# EAGLE design sklpf (EAGLE 7.7.0)
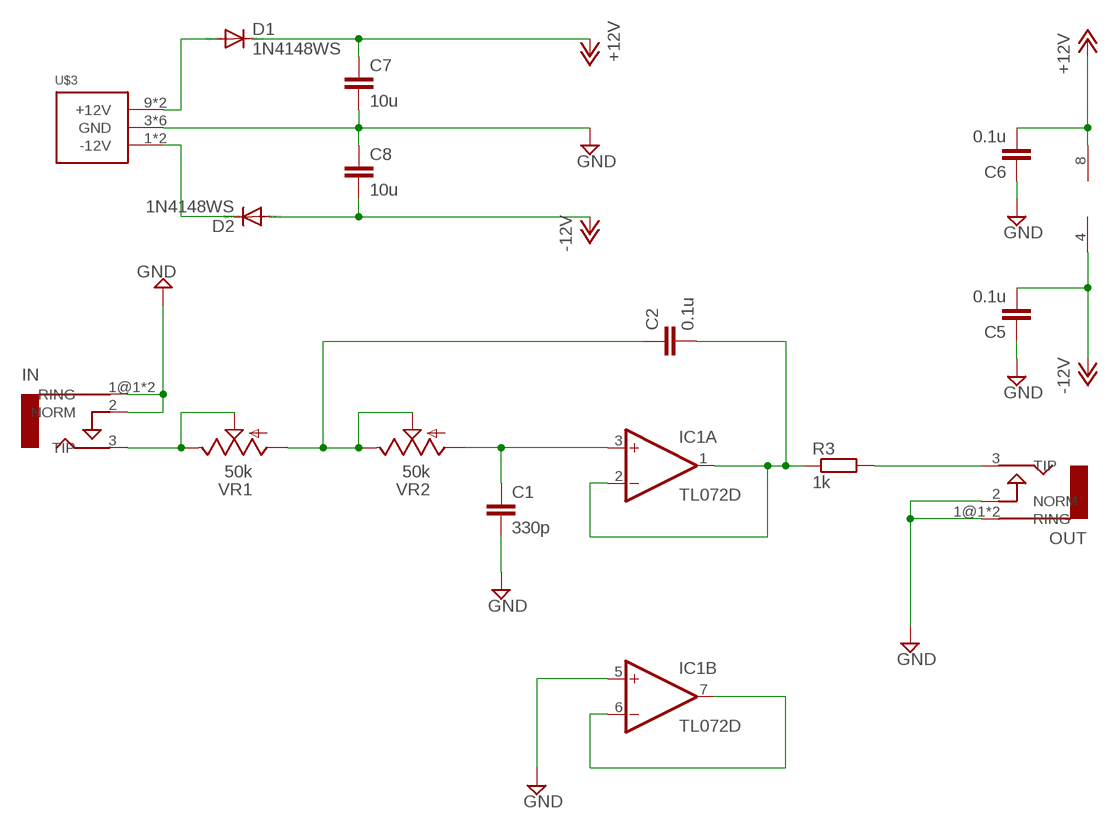
[diagram p0: schematic, sheet 1]

## Parts
C1  330p  C-EUC0805  [C0805]
C2  0.1u  C-EUC0805  [C0805]
C5  0.1u  C-EUC0805  [C0805]
C6  0.1u  C-EUC0805  [C0805]
C7  10u  C-EUC0805  [C0805]
C8  10u  C-EUC0805  [C0805]
D1  1N4148WS  DIODE-SOD323-W  [SOD323-W]
D2  1N4148WS  DIODE-SOD323-W  [SOD323-W]
IC1  TL072D  [SO08]
IN  AUDIO-JACKERTHENVAR  [ERTHENVAR-JACK]
OUT  AUDIO-JACKERTHENVAR  [ERTHENVAR-JACK]
R3  1k  R-EU_R0805  [R0805]
U$3  POWER_SIMPLE10  [POWER_10]
VR1  50k  9MM_SNAP-IN_POT_  [9MM_SNAP-IN_POT]
VR2  50k  9MM_SNAP-IN_POT_  [9MM_SNAP-IN_POT]

## Nets
+12V: C6.2 C7.1 D1.C IC1.8(P:V+)
-12V: C5.2 C8.2 D2.A IC1.4(P:V-)
GND: C1.2 C5.1 C6.1 C7.2 C8.1 IC1.5(B:+IN) IN.1@1(RING) IN.1@2(RING) IN.2(NORM) OUT.1@1(RING) OUT.1@2(RING) OUT.2(NORM) U$3.3(GND) U$3.4(GND) U$3.5(GND) U$3.6(GND) U$3.7(GND) U$3.8(GND)
N$1: C2.2 IC1.1(A:OUT) IC1.2(A:-IN) R3.1
N$2: C1.1 IC1.3(A:+IN) VR2.1(A)
N$3: C2.1 VR1.1(A) VR2.2(S) VR2.3(E)
N$4: IN.3(TIP) VR1.2(S) VR1.3(E)
N$5: IC1.6(B:-IN) IC1.7(B:OUT)
N$6: OUT.3(TIP) R3.2
N$9: D2.C U$3.1(-12V) U$3.2(-12V)
N$10: D1.A U$3.9(+12V) U$3.10(+12V)

## Library data of the parts
C1 C2 C5-C8 = rcl:C-EU: CAPACITOR, European symbol
D1 D2 = diode:DIODE-: DIODE
IC1 = linear:TL072: OP AMP
IN OUT = erthenvar:AUDIO-JACK: Switching Mono 3.5mm Audio Jack from Erthenvar.
R3 = rcl:R-EU_: RESISTOR, European symbol
U$3 = eurorack:POWER_SIMPLE
VR1 VR2 = MusicThingModular:9MM_SNAP-IN_POT: 9mm vertical snap-in pot, Alpha / Panasonic style

## Board
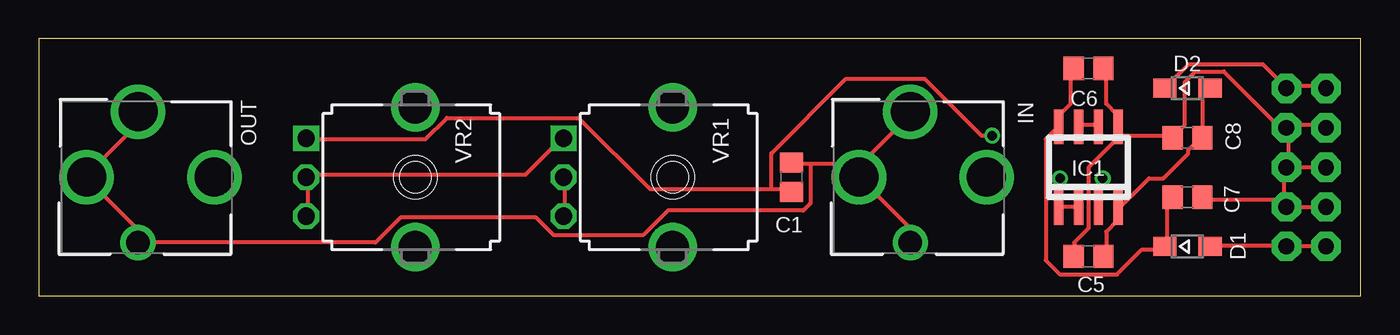
[diagram p1: board, top side]
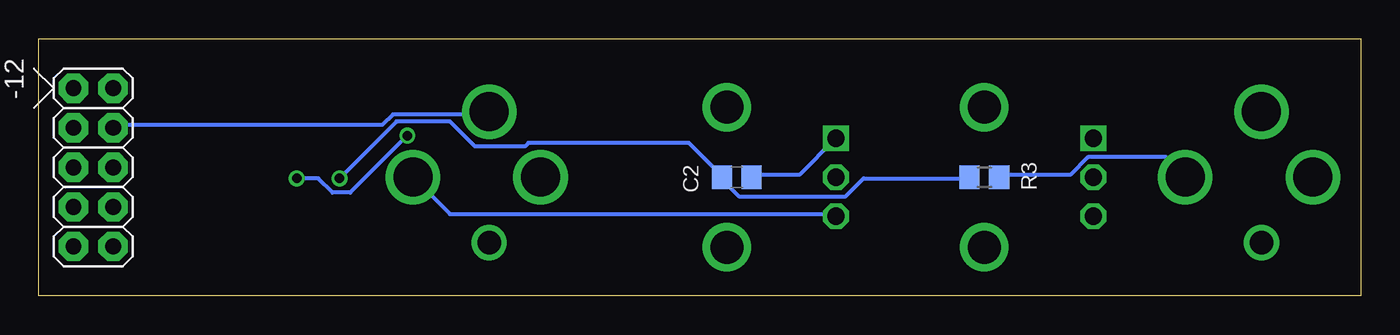
[diagram p2: board, bottom side, seen from below]

Size 84.76 x 16.5 mm. Coordinates in mm from the lower left corner, seen from the top.
Outline: 0,0 84.76,0 84.76,16.5 0,16.5 0,0
Copper layers (1*16): Top 0.035mm / dielectric 1.5mm / Bottom 0.035mm
Design rules "default": minimum track width 10mil, minimum drill 24mil, track to track 8mil, track to pad 8mil, pad to pad 8mil, via to via 8mil, smd to smd 8mil, copper to edge 40mil, drill to drill 8mil, minimum pad ring 10mil, minimum via ring 8mil, stop-mask expansion 4mil, vias tented up to drill 0mil, thermal gap 10mil

### Footprints (pad centres in the part's own frame; a part is rotated, then mirrored left to right if it is on the bottom)
C0805 = smd 1.3 x 1.5: 1 -0.95,0; 2 0.95,0
SOD323-W = smd 1.5 x 1.2: A 1.45,0; C -1.45,0
SO08 = smd 0.6 x 2.2: 1 -1.905,-2.6; 2 -0.635,-2.6; 3 0.635,-2.6; 4 1.905,-2.6; 5 1.905,2.6; 6 0.635,2.6; 7 -0.635,2.6; 8 -1.905,2.6
ERTHENVAR-JACK = drill 2.5: 1@1 -4.2,0; 2 0,-3.3; 3 0,4.9 | drill 1.5: 1@2 4.2,0
R0805 = smd 1.3 x 1.5: 1 -0.95,0; 2 0.95,0
POWER_10 = drill 1.016 pad 1.88 octagon: 1 -5.08,-1.27; 2 -5.08,1.27; 3 -2.54,-1.27; 4 -2.54,1.27; 5 0,-1.27; 6 0,1.27; 7 2.54,-1.27; 8 2.54,1.27; 9 5.08,-1.27; 10 5.08,1.27
9MM_SNAP-IN_POT = drill 1.1 square: 1 -2.5,-7 | drill 1.1 octagon: 2 0,-7; 3 2.5,-7 | drill 2.1 pad 2.794: CHASSIS1 -4.5,0; CHASSIS2 4.5,0

### Placement (x,y rotation side)
C1  48.26,7.62 90 top
C2  40,7.62 180 bottom
C5  67.31,2.54 0 top
C6  67.31,14.61 180 top
C7  73.66,6.35 0 top
C8  73.66,10.16 0 top
D1  73.66,3.17 0 top
D2  73.66,13.34 0 top
IC1  67.31,8.26 0 top
IN  55.88,7.62 270 top
OUT  6.35,7.62 270 top
R3  24.13,7.62 0 bottom
U$3  81.28,8.26 270 bottom
VR1  40.64,7.62 270 top
VR2  24.13,7.62 270 top

### Tracks (layer width: path | path; a pad name or v marks a point on that pad's centre or on a via)
+12V
  Top 0.254: C7.1 72.57,6.17 72.34,5.94 72.34,3.2 D1.C 72.11,2.97 70.74,2.97 69.14,1.37 65.48,1.37 64.57,2.29 64.57,10.06 65.25,10.74 IC1.8 65.48,10.97 65.48,11.66 66.17,12.34 66.17,14.4 C6.2
-12V
  Top 0.254: D2.A 75.08,13.26 74.62,12.8 74.62,10.29 C8.2 74.4,10.06 73.71,9.37 73.71,9.14 72.11,7.54 71.2,7.54 69.37,5.71 IC1.4 69.14,5.49 69.14,4.8 68.45,4.12 68.45,2.74 C5.2
GND
  Top 0.254: U$3.6 80.11,8.23 82.4,8.23 U$3.5 | U$3.4 80.11,10.97 82.4,10.97 U$3.3 | U$3.6 80.11,8.46 80.11,10.74 U$3.4 | 79.43,6.17 74.62,6.17 C7.2 | 79.43,6.17 79.88,5.71 U$3.8 | U$3.8 U$3.7 | 79.43,6.17 79.88,6.63 79.88,8.23 U$3.6 | 79.43,6.17 U$3.8 | 69.14,10.29 69.14,10.74 IC1.5 | 69.14,10.29 69.14,10.06 67.31,8.23 67.31,4.34 66.4,3.43 66.4,2.74 C5.1 | 69.14,10.29 72.57,10.29 C8.1 72.8,10.29 73.48,10.97 73.48,13.72 74.17,14.4 76,14.4 79.43,10.97 79.88,10.97 U$3.4 | 69.14,10.29 IC1.5 | C6.1 68.45,14.4 68.45,12.34 69.14,11.66 69.14,10.97 IC1.5 | OUT.1@1 6.27,11.66 6.27,10.97 3.07,7.77 OUT.2 3.07,7.54 6.27,4.34 6.27,3.43 OUT.1@2 6.5,3.43 21.59,3.43 23.19,5.03 31.88,5.03 33.02,3.89 38.73,3.89 40.33,5.49 49.02,5.49 49.48,5.94 49.48,8.46 | 49.48,8.46 51.76,8.46 52.22,8 | 49.48,8.46 48.34,8.46 C1.2 | 52.22,8 52.45,7.77 IN.2 | IN.1@2 55.88,4.34 52.68,7.54 IN.2 | 52.22,8 55.88,11.66 IN.1@1 | 52.22,8 IN.2
  Bottom 0.254: U$3.4 79.88,10.97 62.74,10.97 62.05,11.66 55.88,11.66 IN.1@1
N$1  (via drill 0.61)
  Top 0.254: 65.48,5.71 66.62,5.71 IC1.2 | v65.48,7.54 65.48,5.71 | 65.48,5.71 IC1.1
  Bottom 0.254: R3.1 25.25,7.54 31.88,7.54 33.02,6.4 39.88,6.4 41.02,7.54 C2.2 41.02,7.77 43.08,9.83 53.36,9.83 53.59,9.6 56.79,9.6 58.39,11.2 61.82,11.2 v65.48,7.54
N$2  (via drill 0.61)
  Top 0.254: 46.96,6.86 39.19,6.86 34.62,11.43 26.16,11.43 24.79,10.06 17.25,10.06 VR2.1 | 46.96,6.86 48.11,6.86 C1.1 | v68.22,7.54 68,7.32 68,5.71 IC1.3 | v61.14,10.29 60.45,10.29 56.79,13.95 51.76,13.95 46.96,9.14 46.96,6.86
  Bottom 0.254: v68.22,7.54 66.85,7.54 65.94,6.63 64.8,6.63 v61.14,10.29
N$3
  Top 0.254: VR2.3 17.25,5.26 17.25,7.54 VR2.2 17.25,7.77 31.19,7.77 33.48,10.06 VR1.1
  Bottom 0.254: C2.1 38.96,7.77 35.99,7.77 33.71,10.06 VR1.1
N$4
  Top 0.254: VR1.3 33.71,5.26 33.71,7.54 VR1.2
  Bottom 0.254: VR1.3 33.71,5.26 58.39,5.26 60.68,7.54 IN.3
N$5
  Top 0.254: IC1.7 66.85,10.97 67.77,10.97 IC1.6
N$6
  Bottom 0.254: R3.2 22.96,7.77 18.62,7.77 17.48,8.91 12.45,8.91 11.3,7.77 OUT.3
N$9
  Top 0.254: D2.C 72.34,13.49 73.71,14.86 78.51,14.86 79.88,13.49 U$3.2 80.11,13.49 82.4,13.49 U$3.1
N$10
  Top 0.254: D1.A 75.31,3.2 79.88,3.2 U$3.10 80.11,3.2 82.4,3.2 U$3.9